# EAGLE design leo_joy_gamer (EAGLE 6.3)
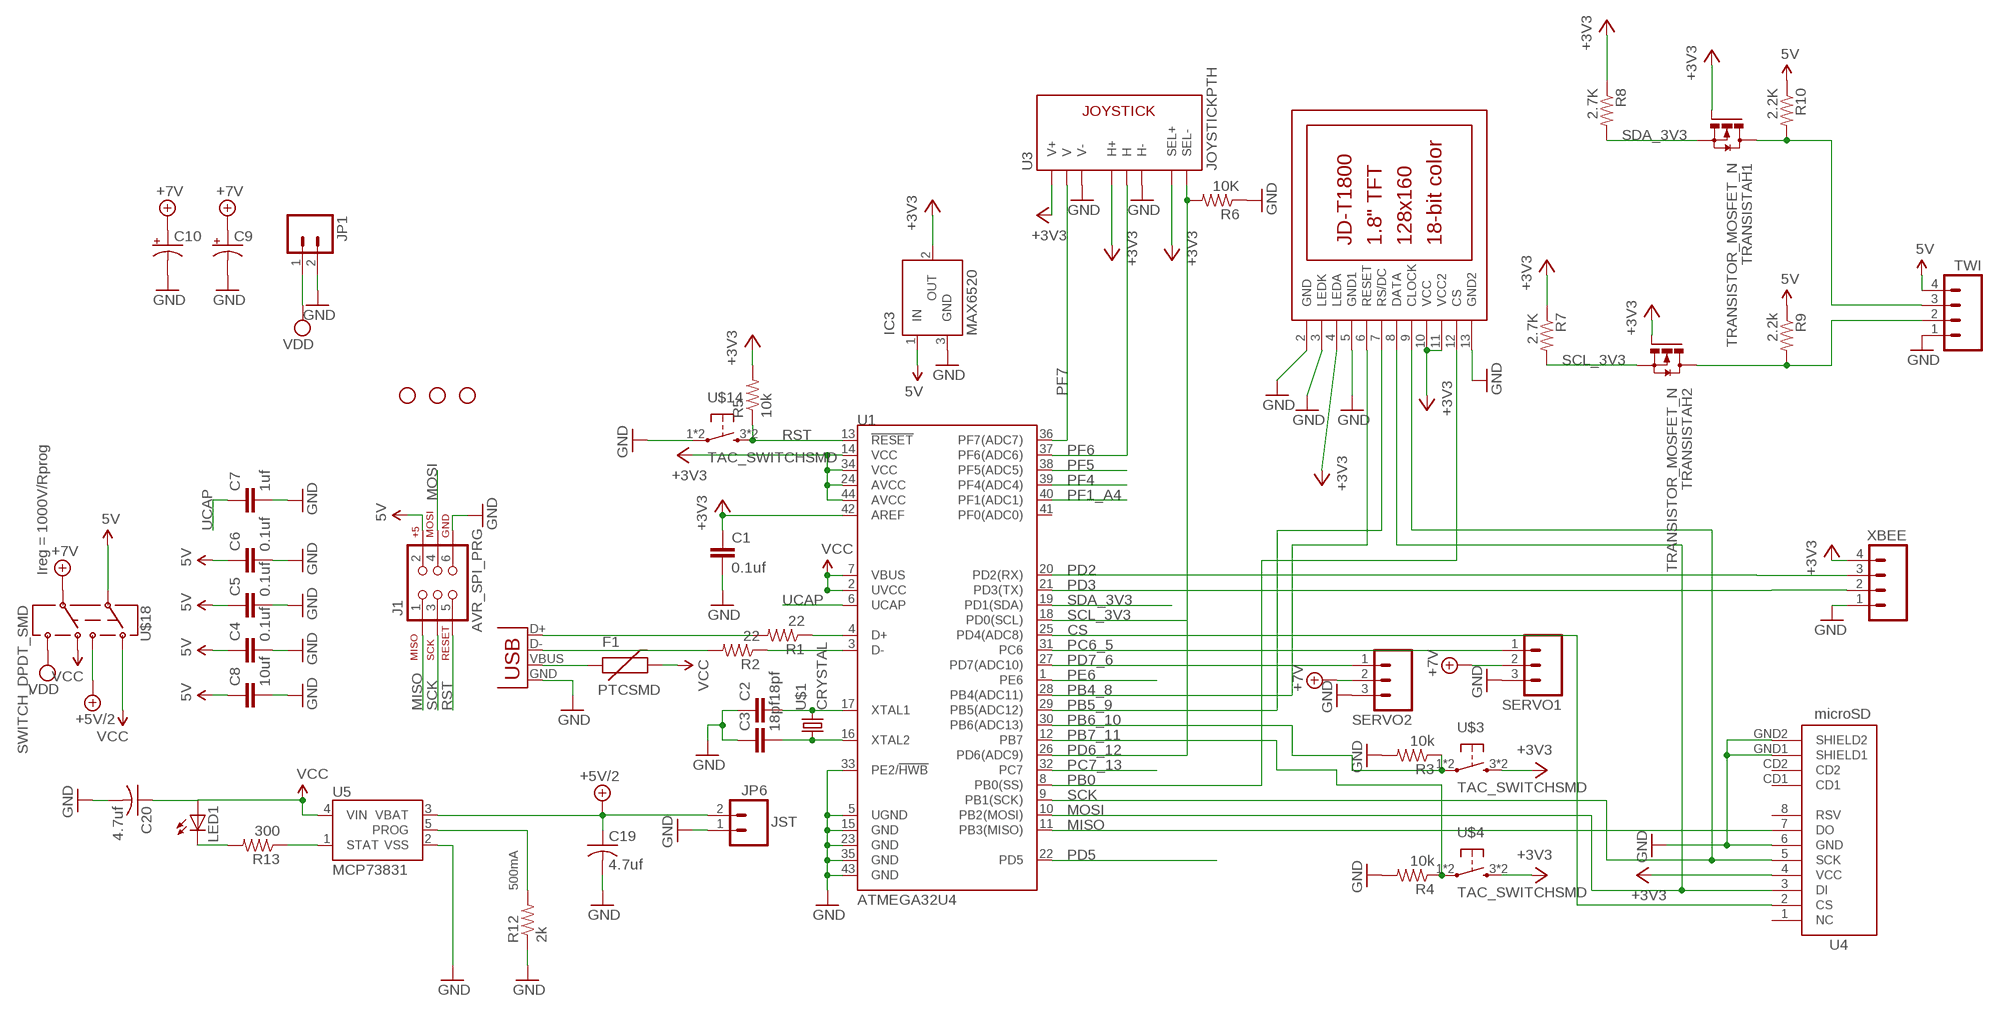
[diagram p0: schematic, sheet 1]

## Parts
C1  0.1uf  CAP0805  [0805]
C2  18pf  CAP0805  [0805]
C3  18pf  CAP0805  [0805]
C4  0.1uf  CAP0805  [0805]
C5  0.1uf  CAP0805  [0805]
C6  0.1uf  CAP0805  [0805]
C7  1uf  CAP0805  [0805]
C8  10uf  CAP0805  [0805]
C9  CPOL-USD  [PANASONIC_D]
C10  CPOL-USD  [PANASONIC_D]
C19  4.7uf  C-USC0603  [C0603]
C20  4.7uf  C-USC0603  [C0603]
F1  PTCSMD  [PTC-1206]
IC3  MAX6520  [SOT23]
J1  AVR_SPI_PRG  AVR_SPI_PRG_6PTH  [2X3]
JP1  M02LOCK  [1X02_LOCK]
JP2  STAND-OFF  [STAND-OFF]
JP3  STAND-OFF  [STAND-OFF]
JP4  STAND-OFF  [STAND-OFF]
JP6  JST  M02JST-PTH-2  [JST-2-PTH]
LCD1  JD-T1800  [JD-T1800]
LED1  LEDCHIPLED_1206  [CHIPLED_1206]
R1  22  R-US_M0805  [M0805]
R2  22  R-US_M0805  [M0805]
R3  10k  R-US_M0805  [M0805]
R4  10k  R-US_M0805  [M0805]
R5  10k  R-US_M0805  [M0805]
R6  10K  R-US_R0603  [R0603]
R7  2.7K  R-US_M0805  [M0805]
R8  2.7K  R-US_M0805  [M0805]
R9  2.2k  R-US_M0805  [M0805]
R10  2.2K  R-US_M0805  [M0805]
R12  2k  R-US_R0805  [R0805]
R13  300  R-US_R0805  [R0805]
SERVO1  M03LOCK  [1X03_LOCK]
SERVO2  M03LOCK  [1X03_LOCK]
TRANSISTAH1  TRANSISTOR_MOSFET_N  [SOT23]
TRANSISTAH2  TRANSISTOR_MOSFET_N  [SOT23]
TWI  M04LOCK  [1X04_LOCK]
U1  ATMEGA32U4  ATMEGA32U4QFN2  [QFN-44-NOPAD]
U3  JOYSTICKPTH  [JOYSTICK]
U4  microSD  USD-SOCKETSMD  [MICRO-SD-SOCKET-PP]
U5  MCP73831  [SOT23-5]
U$1  CRYSTAL  [CRYSTAL_SMD]
U$3  TAC_SWITCHSMD  [TAC_SWITCH_SMD]
U$4  TAC_SWITCHSMD  [TAC_SWITCH_SMD]
U$14  TAC_SWITCHSMD  [TAC_SWITCH_SMD]
U$18  SWITCH_DPDT_SMD  [SWITCH_DPDT]
X2  USB-MICROB  [USB-MICROB]
XBEE  M04LOCK  [1X04_LOCK]

## Nets
5V: C4.1 C5.1 C6.1 C8.1 IC3.1(IN) J1.2 R9.1 R10.1 TWI.4 U$18.7
+3V3: C1.1 IC3.2(OUT) LCD1.4(LEDA) LCD1.10(VCC) LCD1.11(VCC2) R5.2 R7.1 R8.1 TRANSISTAH1.1(G) TRANSISTAH2.1(G) U1.14(VCC) U1.24(AVCC) U1.34(VCC) U1.42(AREF) U1.44(AVCC) U3.B1A(SEL+) U3.H1(H+) U3.V1(V+) U4.4(VCC) U$3.3 U$3.4 U$4.3 U$4.4 XBEE.4
+5V/2: C19.1 JP6.2 U5.3(VBAT) U$18.8
+7V: C9.+ C10.+ SERVO1.2 SERVO2.2 U$18.10
CS: U1.25(PD4(ADC8)) U4.2(CS)
D+: R1.2 X2.D+
D-: R2.2 X2.D-
GND: C1.2 C2.1 C3.1 C4.2 C5.2 C6.2 C7.2 C8.2 C9.- C10.- C19.2 C20.2 IC3.3(GND) J1.6 JP1.2 JP6.1 LCD1.2(GND) LCD1.3(LEDK) LCD1.5(GND1) LCD1.13(GND2) R3.2 R4.2 R6.1 R12.1 SERVO1.3 SERVO2.3 TWI.1 U1.5(UGND) U1.15(GND) U1.23(GND) U1.33(PE2/!HWB) U1.35(GND) U1.43(GND) U3.H3(H-) U3.V3(V-) U4.6(GND) U4.GND1(SHIELD1) U4.GND2(SHIELD2) U5.2(VSS) U$14.1 U$14.2 X2.GND XBEE.1
MISO: J1.1 U1.11(PB3(MISO)) U4.7(DO)
MOSI: J1.4 LCD1.8(DATA) U1.10(PB2(MOSI)) U4.3(DI)
N$2: C2.2 U1.17(XTAL1) U$1.2
N$3: C3.2 U1.16(XTAL2) U$1.1
N$6: R1.1 U1.4(D+)
N$8: R2.1 U1.3(D-)
N$13: R13.1 U5.1(STAT)
N$14: LED1.C R13.2
PB0: LCD1.12(CS) U1.8(PB0(SS))
PB4_8: LCD1.6(RESET) U1.28(PB4(ADC11))
PB5_9: LCD1.7(RS/DC) U1.29(PB5(ADC12))
PB6_10: R3.1 U1.30(PB6(ADC13)) U$3.1 U$3.2
PB7_11: R4.1 U1.12(PB7) U$4.1 U$4.2
PC6_5: SERVO1.1 U1.31(PC6)
PC7_13: U1.32(PC7)
PD2: U1.20(PD2(RX)) XBEE.3
PD3: U1.21(PD3(TX)) XBEE.2
PD5: U1.22(PD5)
PD6_12: R6.2 U1.26(PD6(ADC9)) U3.B2A(SEL-)
PD7_6: SERVO2.1 U1.27(PD7(ADC10))
PE6: U1.1(PE6)
PF1_A4: U1.40(PF1(ADC1))
PF4: U1.39(PF4(ADC4))
PF5: U1.38(PF5(ADC5))
PF6: U1.37(PF6(ADC6)) U3.H2(H)
PF7: U1.36(PF7(ADC7)) U3.V2(V)
PROG: R12.2 U5.5(PROG)
RST: J1.5 R5.1 U1.13(!RESET) U$14.3 U$14.4
SCK: J1.3 LCD1.9(CLOCK) U1.9(PB1(SCK)) U4.5(SCK)
SCL: R9.2 TRANSISTAH2.3(D) TWI.2
SCL_3V3: R7.2 TRANSISTAH2.2(S) U1.18(PD0(SCL))
SDA: R10.2 TRANSISTAH1.3(D) TWI.3
SDA_3V3: R8.2 TRANSISTAH1.2(S) U1.19(PD1(SDA))
UCAP: C7.1 U1.6(UCAP)
VBUS: F1.1 X2.VBUS
VCC: C20.1 F1.2 LED1.A U1.2(UVCC) U1.7(VBUS) U5.4(VIN) U$18.1 U$18.9
VDD: JP1.1 U$18.11
Unconnected: U1.41(PF0(ADC0)) U4.1(NC) U4.8(RSV) U4.CD1 U4.CD2

## Notes on the sheet
- Ireg = 1000V/Rprog
- 500mA

## Library data of the parts
C1-C8 = SparkFun:CAP: Capacitor Standard 0603 ceramic capacitor, and 0.1" leaded capacitor.
C9 C10 = resistor:CPOL-US: POLARIZED CAPACITOR, American symbol
C19 C20 = resistor:C-US: CAPACITOR, American symbol
F1 = SparkFun:PTC: Resettable Fuse PTC Resettable Fuse. Spark Fun Electronics SKU : COM-08357
IC3 = maxim:MAX6520: 1.2V Voltage Reference 50ppm/°C, SOT23, 3-Terminal Source: http://datasheets.maxim-ic.com/en/ds/MAX6520.pdf
J1 = SparkFun:AVR_SPI_PRG_6: AVR ISP 6 Pin This is the reduced ISP connector for AVR programming. Common on Arduino. This footprint will take up less PCB space and can be used with a 10-pin to 6-pin adapter such as SKU: BOB-08508
JP1 JP6 = SparkFun:M02: Header 2 Standard 2-pin 0.1" header. Use with straight break away headers (SKU : PRT-00116), right angle break away headers (PRT-00553), swiss pins (PRT-00743), machine pins (PRT-00117), and female headers (PRT-00115). Molex polarized connector foot print use with SKU : PRT-08233 with associated crimp pins and housings.
JP2-JP4 = SparkFun:STAND-OFF: Stand Off This is the mechanical footprint for a #4 phillips button head screw. Use the keepout ring to avoid running the screw head into surrounding components. SKU : PRT-00447
LCD1 = adafruit:JD-T1800
LED1 = adafruit:LED: LED OSRAM: - CHIPLED LG R971, LG N971, LY N971, LG Q971, LY Q971, LO R971, LY R971 LH N974, LH R974 LS Q976, LO Q976, LY Q976 LO Q996 - Hyper CHIPLED LW Q18S LB Q993, LB Q99A, LB R99A - SideLED LS A670, LO A670, LY A670, LG A670, LP A670 LB A673, LV A673, LT A673, LW A673 LH A674 LY A675 LS A676, LA A676, LO A676, LY A676, LW A676 LS A679, LY A679, LG A679 - Hyper Micro SIDELED® LS Y876, LA Y876, LO Y876, LY Y876 LT Y87S - SmartLED LW L88C, LW L88S LB L89C, LB L89S, LG L890 LS L89K, LO L89K, LY L89K LS L896, LA L896, LO L896, LY L896 - TOPLED LS T670, LO T670, LY T670, LG T670, LP T670 LSG T670, LSP T670, LSY T670, LOP T670, LYG T670 LG T671, LOG T671, LSG T671 LB T673, LV T673, LT T673, LW T673 LH T674 LS T676, LA T676, LO T676, LY T676, LB T676, LH T676, LSB T676, LW T676 LB T67C, LV T67C, LT T67C, LS T67K, LO T67K, LY T67K, LW E67C LS E67B, LA E67B, LO E67B, LY E67B, LB E67C, LV E67C, LT E67C LW T67C LS T679, LY T679, LG T679 LS T770, LO T770, LY T770, LG T770, LP T770 LB T773, LV T773, LT T773, LW T773 LH T774 LS E675, LA E675, LY E675, LS T675 LS T776, LA T776, LO T776, LY T776, LB T776 LHGB T686 LT T68C, LB T68C - Hyper Mini TOPLED® LB M676 - Mini TOPLED Santana® LG M470 LS M47K, LO M47K, LY M47K Source: http://www.osram.convergy.de/
R1-R10 R12 R13 = resistor:R-US_: RESISTOR, American symbol
SERVO1 SERVO2 = SparkFun:M03: Header 3 Standard 3-pin 0.1" header. Use with straight break away headers (SKU : PRT-00116), right angle break away headers (PRT-00553), swiss pins (PRT-00743), machine pins (PRT-00117), and female headers (PRT-00115). Molex polarized connector foot print use with SKU : PRT-08232 with associated crimp pins and housings.
TRANSISTAH1 TRANSISTAH2 = sam:TRANSISTOR_MOSFET_N
TWI XBEE = SparkFun:M04: Header 4 Standard 4-pin 0.1" header. Use with straight break away headers (SKU : PRT-00116), right angle break away headers (PRT-00553), swiss pins (PRT-00743), machine pins (PRT-00117), and female headers (PRT-00115). Molex polarized connector foot print use with SKU : PRT-08231 with associated crimp pins and housings. 1MM SMD Version SKU: PRT-10208
U1 = SparkFun:ATMEGA32U4
U3 = SparkFun:JOYSTICK: Thumb Joystick Joystick commonly found in PS2 controllers. Two pots and a select switch. Footprint proven. Spark Fun Electronics SKU : COM-09032
U4 = SparkFun:USD-SOCKET: microSD Socket Push-push type uSD socket. Schematic element and footprint production proven. Spark Fun Electronics SKU : PRT-00127. tDoc lines correctly indicate media card edge positions when inserting (unlocked, locked, depressed).
U5 = SparkFun:MCP73831: Microchip's MCP73831 Miniature single cell, fully integrated Li-Ion, Li-polymer charge management controller http://ww1.microchip.com/downloads/en/DeviceDoc/21984a.pdf
U$1 = sam:CRYSTAL
U$3 U$4 U$14 = sam:TAC_SWITCH
U$18 = sam:SWITCH_DPDT_SMD
X2 = SparkFun:USB: USB Connectors USB-B-PTH is fully proven SKU : PRT-00139 USB-miniB is fully proven SKU : PRT-00587 USB-A-PCB is untested. USB-A-H is throughly reviewed, but untested. Spark Fun Electronics SKU : PRT-00437 USB-B-SMT is throughly reviewed, but untested. Needs silkscreen touching up. USB-A-S has not been used/tested USB-MB-H has not been used/tested

## Board
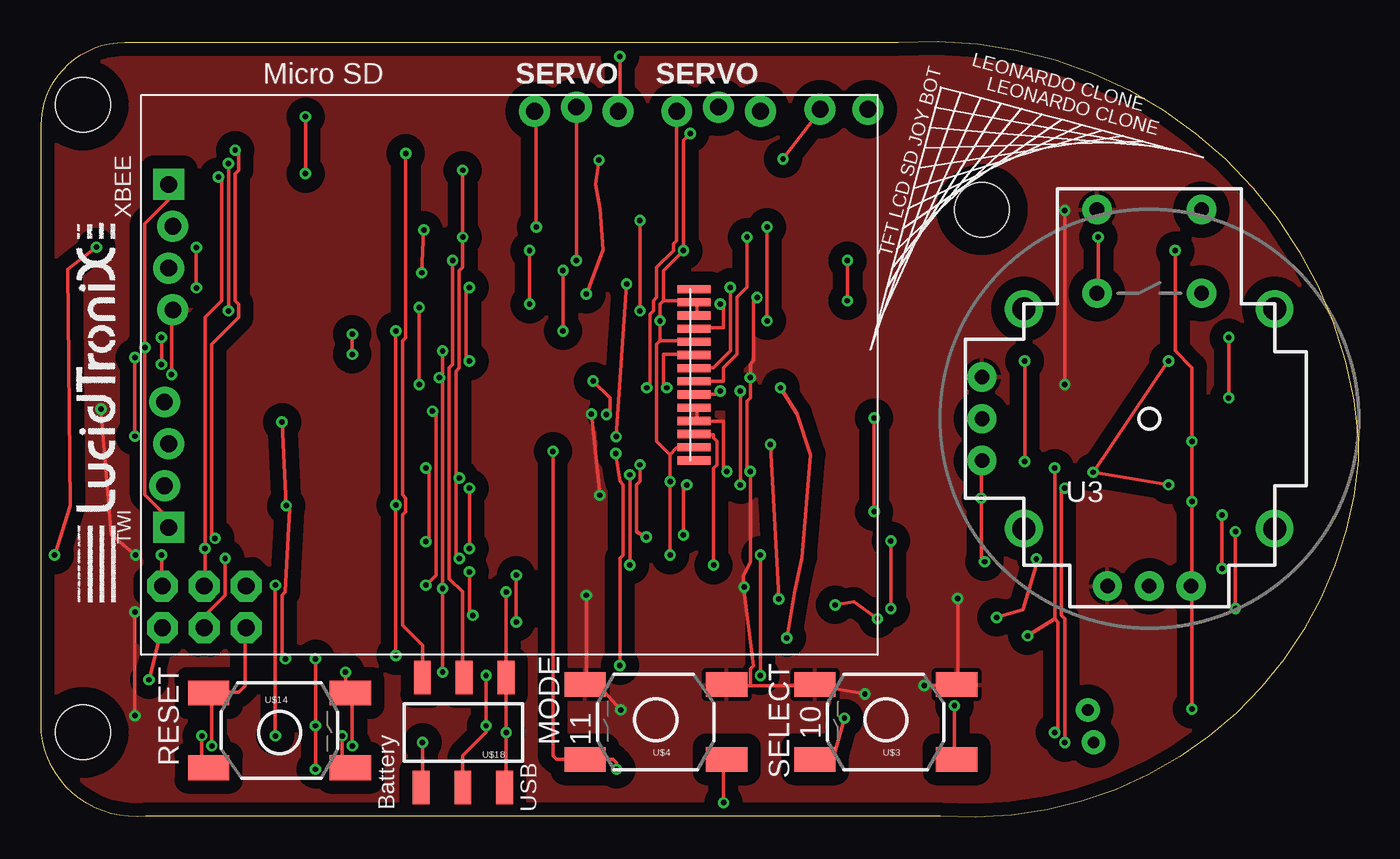
[diagram p1: board, top side]
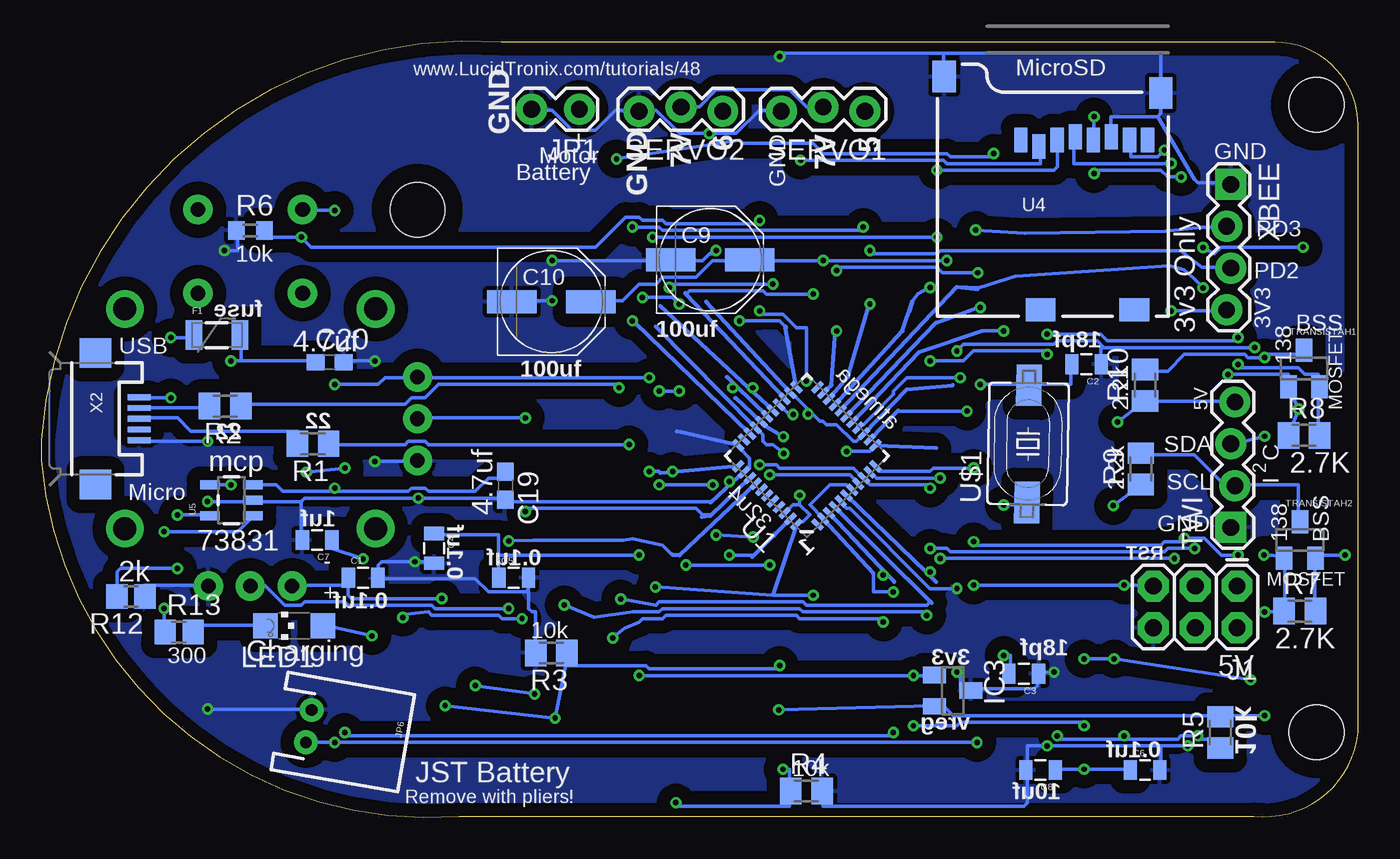
[diagram p2: board, bottom side, seen from below]

Size 80.01 x 47.13 mm. Coordinates in mm from the lower left corner, seen from the top.
Outline: 6.35,0.08 arc-90 0,5.16 0,41.99 arc-90 5.08,47.07 52.07,47.07 arc-90 80.01,22.94 80.01,21.67 arc-90 54.61,0.08 6.35,0.08
Copper layers (1*16): Top 0.0356mm / dielectric 1.5011mm / Bottom 0.0356mm
Design rules "LaenPCBOrder *": minimum track width 8mil, minimum drill 13mil, track to track 6mil, track to pad 6mil, pad to pad 6mil, via to via 6mil, smd to smd 6mil, copper to edge 15mil, drill to drill 6mil, minimum pad ring 7mil, minimum via ring 7mil, stop-mask expansion 4mil, vias tented up to drill 25mil, thermal gap 10mil

### Footprints (pad centres in the part's own frame; a part is rotated, then mirrored left to right if it is on the bottom)
0805 = smd 0.8 x 1.2: 1 -0.9,0; 2 0.9,0
PANASONIC_D = smd 3 x 1.4: + 2.4,0; - -2.4,0
C0603 = smd 1.1 x 1: 1 -0.85,0; 2 0.85,0
PTC-1206 = smd 1 x 1.8: 1 -1.4,0; 2 1.4,0
SOT23 = smd 1 x 1.4: 1 -0.95,-1.1; 2 0.95,-1.1; 3 0,1.1
2X3 = drill 1.016 pad 1.88 octagon: 1 0,0; 2 0,2.54; 3 2.54,0; 4 2.54,2.54; 5 5.08,0; 6 5.08,2.54
1X02_LOCK = drill 1.016 pad 1.88: 1 -0.178,0; 2 2.718,0
STAND-OFF = hole 3.302: 0,0
JST-2-PTH = drill 0.7 pad 1.448: 1 -1,0; 2 1,0
JD-T1800 = smd 0.5 x 2: 1 5.2,-13.1; 2 4.4,-13.1; 3 3.6,-13.1; 4 2.8,-13.1; 5 2,-13.1; 6 1.2,-13.1; 7 0.4,-13.1; 8 -0.4,-13.1; 9 -1.2,-13.1; 10 -2,-13.1; 11 -2.8,-13.1; 12 -3.6,-13.1; 13 -4.4,-13.1; 14 -5.2,-13.1
CHIPLED_1206 = smd 1.5 x 1.5: A 0,-1.75; C 0,1.75
M0805 = smd 1.3 x 1.6: 1 -0.95,0; 2 0.95,0
R0603 = smd 1 x 1.1: 1 -0.85,0; 2 0.85,0
R0805 = smd 1.3 x 1.5: 1 -0.85,0; 2 0.85,0
1X03_LOCK = drill 1.016 pad 1.88: 1 0,0.127; 2 2.54,-0.127; 3 5.08,0.127
1X04_LOCK = drill 1.016 pad 1.88 square: 1 0,0.127 | drill 1.016 pad 1.88: 2 2.54,-0.127; 3 5.08,0.127; 4 7.62,-0.127
QFN-44-NOPAD = smd 0.8 x 0.3: 1 -3.4,2.5; 2 -3.4,2; 3 -3.4,1.5; 4 -3.4,1; 5 -3.4,0.5; 6 -3.4,0; 7 -3.4,-0.5; 8 -3.4,-1; 9 -3.4,-1.5; 10 -3.4,-2; 11 -3.4,-2.5; 23 3.4,-2.5; 24 3.4,-2; 25 3.4,-1.5; 26 3.4,-1; 27 3.4,-0.5; 28 3.4,0; 29 3.4,0.5; 30 3.4,1; 31 3.4,1.5; 32 3.4,2; 33 3.4,2.5 | smd 0.3 x 0.8: 12 -2.5,-3.4; 13 -2,-3.4; 14 -1.5,-3.4; 15 -1,-3.4; 16 -0.5,-3.4; 17 0,-3.4; 18 0.5,-3.4; 19 1,-3.4; 20 1.5,-3.4; 21 2,-3.4; 22 2.5,-3.4; 34 2.5,3.4; 35 2,3.4; 36 1.5,3.4; 37 1,3.4; 38 0.5,3.4; 39 0,3.4; 40 -0.5,3.4; 41 -1,3.4; 42 -1.5,3.4; 43 -2,3.4; 44 -2.5,3.4
JOYSTICK = drill 0.9 pad 1.778: B1A -3.175,12.7; B1B 3.175,12.7; B2A -3.175,7.62; B2B 3.175,7.62 | drill 0.889 pad 1.778: H1 -2.54,-10.16; H2 0,-10.16; H3 2.54,-10.16; V1 -10.16,2.54; V2 -10.16,0; V3 -10.16,-2.54 | drill 1.397 pad 2.286: MOUNT1 -7.62,6.668; MOUNT2 -7.62,-6.668; MOUNT3 7.62,-6.668; MOUNT4 7.62,6.668
MICRO-SD-SOCKET-PP = smd 0.8 x 1.5: 1 -8.94,10.7; 2 -7.84,10.3; 3 -6.74,10.7; 4 -5.64,10.9; 5 -4.54,10.7; 6 -3.44,10.9; 7 -2.34,10.7; 8 -1.24,10.7 | smd 1.8 x 1.4: CD1 -7.75,0.4; CD2 -2.05,0.4 | smd 1.4 x 1.9: GND1 -13.6,14.55; GND2 -0.45,13.55
SOT23-5 = smd 0.55 x 1.2: 1 -0.95,-1.3; 2 0,-1.3; 3 0.95,-1.3; 4 0.95,1.3; 5 -0.95,1.3
CRYSTAL_SMD = smd 2.54 x 1.524: 1 -3.556,0; 2 3.556,0
TAC_SWITCH_SMD = smd 2.5 x 1.5: 1 -4.302,2.397; 2 4.302,2.397; 3 -4.302,-2.143; 4 4.302,-2.143
SWITCH_DPDT = smd 1.016 x 2.032: 1 -2.5,3.333; 7 0.04,3.333; 8 2.58,3.333; 9 -2.58,-3.333; 10 -0.04,-3.333; 11 2.5,-3.333
USB-MICROB = smd 0.35 x 1.4: D+ 0,2.65; D- -0.65,2.65; GND 1.3,2.65; ID 0.65,2.65; VBUS -1.3,2.65 | smd 1.8 x 1.9: MT1 -4,0; MT2 4,0

### Placement (x,y rotation side)
C1  60.45,14.55 0 bottom
C2  16.51,27.51 180 bottom
C3  20.32,8.71 180 bottom
C4  56.13,16.33 270 bottom
C5  51.31,14.55 0 bottom
C6  12.95,2.87 0 bottom
C7  63.25,16.84 180 bottom
C8  19.3,2.87 180 bottom
C9  39.37,33.86 0 bottom
C10  49.02,31.32 0 bottom
C19  51.82,20.14 270 bottom
C20  62.48,27.63 0 bottom
F1  69.34,29.29 0 bottom
IC3  24.64,7.7 270 bottom
J1  7.37,14.05 180 bottom
JP1  47.5,43 180 bottom
JP2  2.54,5.16 0 top
JP3  57.15,36.91 0 top
JP4  2.54,43.26 0 top
JP6  63.75,5.54 260 bottom
LCD1  26.54,26.87 90 top
LED1  64.64,11.63 90 bottom
R1  63.5,22.68 180 bottom
R2  68.83,24.97 180 bottom
R3  49.02,9.98 180 bottom
R4  33.53,1.6 0 bottom
R5  8.38,5.16 90 bottom
R6  67.31,35.64 0 bottom
R7  3.56,12.52 0 bottom
R8  3.3,23.19 0 bottom
R9  13.21,21.16 90 bottom
R10  12.95,26.24 90 bottom
R12  74.55,13.41 180 bottom
R13  71.63,11.25 0 bottom
SERVO1  29.97,43 180 bottom
SERVO2  38.61,43 180 bottom
TRANSISTAH1  3.3,27.25 0 bottom
TRANSISTAH2  3.56,16.84 0 bottom
TWI  7.62,17.6 90 bottom
U1  33.5,21.95 135 bottom
U3  67.31,24.21 0 top
U4  11.56,30.43 0 bottom
U5  68.45,19.25 90 bottom
U$1  20.07,22.68 89 bottom
U$3  51.31,5.92 180 top
U$4  37.34,5.92 180 top
U$6  [LUCIDTRONIX_LOGO_.75_INCH]  5.08,12.52 90 top
U$14  14.48,5.16 0 top
U$18  25.65,5.16 180 top
X2  76.71,24.21 270 bottom
XBEE  7.87,38.43 270 bottom

### Tracks (layer width: path | path; a pad name or v marks a point on that pad's centre or on a via)
5V  (via drill 0.33)
  Top 0.203: v14.63,24 v14.88,18.92 15.09,18.72 14.83,13.69 14.63,13.49 14.63,9.83 v14.83,9.63 | v27.03,8.61 v27.03,5.56 27.03,5.16 25.6,3.73 25.6,1.9 U$18.7 | v16.66,2.92 v16.66,5.56 v16.66,9.63 | v43.69,8.61 v43.69,15.93 | v6.55,8.36 7.32,11.45 J1.2
  Bottom 0.203: v14.88,18.92 13.21,20.19 R9.1 | v14.63,24 13.01,25.27 R10.1 12.8,25.27 7.52,25.27 TWI.4 | 52.22,15.93 52.22,17.14 56.08,17.14 C4.1 | 52.22,15.93 52.22,14.71 C5.1 | C8.1 18.29,2.92 v16.66,2.92 14.02,2.92 C6.1 | IC3.1 25.81,8.61 v27.03,8.61 v43.69,8.61 | v16.66,5.56 16.87,5.77 24.18,5.77 24.38,5.56 v27.03,5.56 | v43.69,15.93 52.22,15.93 | v16.66,9.63 v14.83,9.63 v6.55,8.36
+3V3  (via drill 0.33)
  Top 0.203: v55.68,13.28 55.68,8.2 U$3.3 55.47,8 v53.65,8 | 43.08,8 46.94,8 U$3.4 47.14,8 v50.04,7.49 | 43.08,8 41.66,8 U$4.3 | LCD1.10 39.83,24.87 39.83,24.26 LCD1.11 39.83,24.05 41.45,24.05 41.45,21.21 v41.66,21.01 | v41.25,31.17 41.45,30.96 41.45,29.74 39.83,29.74 LCD1.4 | v43.48,31.57 43.28,31.37 43.28,27.71 43.08,27.51 v43.08,26.69 43.08,25.48 42.88,25.27 42.88,21.21 v43.08,21.01 43.08,15.52 42.65,14.68 42.65,13.99 | 43.08,8 43.08,9.02 43.28,9.22 42.65,13.99 | v33.12,13.49 33.12,8.2 U$4.4 32.92,8 32.11,8 33.93,7.92 v35.2,6.53 | v33.93,19.56 v33.43,24.48 | v42.7,13.99 42.65,13.99 | v5.69,6.17 v5.69,12.47 | v11.38,30.76 v11.38,39.7 | v7.92,26.9 7.92,30.76 XBEE.4 | v5.74,15.93 4.27,17.14 v3.63,24.79 | v62.18,26.29 v62.18,36.85
  Bottom 0.203: 61.37,14.1 61.37,14.5 C1.1 61.37,14.1 | 61.37,14.1 64.62,14.1 U3.H1 | v55.68,13.28 61.16,13.28 61.37,13.49 61.37,14.1 | v41.25,31.17 41.66,31.57 v43.48,31.57 | v43.08,21.01 42.47,21.01 42.42,20.9 | v41.66,21.01 41.65,20.97 | v43.08,26.69 57.1,26.69 U3.V1 57.3,26.69 59.13,26.69 59.54,26.29 v62.18,26.29 | v50.04,7.49 v53.65,8 | 33.53,24.87 34.34,25.68 U1.24 | 33.53,24.87 32.72,24.05 32.51,24.05 32.31,23.85 31.7,23.85 30.68,22.83 30.48,22.83 30.07,23.24 U1.14 | 33.93,18.97 34.34,18.97 34.75,18.57 U1.42 | 33.93,18.97 33.33,18.36 33.73,17.96 33.93,17.96 U1.44 | v33.12,13.49 35.56,13.49 | v35.2,6.53 25.81,6.78 IC3.2 25.6,6.78 25.2,6.78 24.59,6.17 8.53,6.17 R5.2 8.33,6.17 v5.69,6.17 | v33.43,24.48 33.53,24.87 | 33.93,18.97 v33.93,19.56 | 35.56,13.49 v42.7,13.99 | 35.56,13.49 35.56,13.54 | v5.69,12.47 4.67,12.47 R7.1 4.47,12.67 4.47,15.72 TRANSISTAH2.1 5.23,15.93 v5.74,15.93 | R8.1 4.27,23.24 v3.63,24.79 4.27,26.09 TRANSISTAH1.1 4.27,26.29 4.27,26.9 v7.92,26.9 | v11.38,39.7 17.27,39.7 17.27,41.33 U4.4 | v11.38,30.76 8.13,30.76 XBEE.4 | v62.18,36.85 64.01,36.85 U3.B1A
  Bottom 0.229: U1.24 39.62,31.32 | U1.34 41.65,20.97 42.42,20.9 | U1.44 35.56,13.54 | U1.14 27.43,25.98 24.64,26.24
  pour Top (isolate 0.813): -6.22,-16.56 -1.02,55.45 90.42,56.72 81.41,-16.56
+5V/2  (via drill 0.33)
  Top 0.203: v23.16,4.55 23.16,1.9 U$18.8 | v62.18,19.99 61.98,19.79 61.98,12.27 62.18,12.06 v62.18,4.55
  Bottom 0.203: C19.1 51.82,20.6 52.83,20.6 53.65,19.79 56.49,19.79 56.69,19.99 57.51,19.99 57.71,19.79 62.18,19.79 | 62.18,19.79 65.33,19.79 65.73,20.19 67.06,20.19 U5.3 | v23.16,4.55 v62.18,4.55 63.8,4.55 JP6.2 | v62.18,19.99 62.18,19.79
+7V  (via drill 0.33)
  Top 0.203: v24.99,33.81 24.99,27.51 24.79,27.3 24.79,14.5 25.6,13.69 25.6,8.61 U$18.10 | v32.51,33.81 SERVO1.2
  Bottom 0.203: SERVO2.2 41.05,43.15 40.03,43.15 39.01,44.17 34.54,44.17 33.53,43.15 32.51,43.15 SERVO1.2 | v24.99,33.81 v32.51,33.81 36.78,33.81 C9.+ 36.98,33.81 39.22,33.81 40.23,32.79 42.27,32.79 42.67,32.38 43.69,32.38 44.7,31.37 46.53,31.37 C10.+
CS  (via drill 0.33)
  Top 0.203: v33.88,39.9 33.68,38.43 33.93,36.96 34.14,34.47 v33.12,31.77
  Bottom 0.203: v33.88,39.9 25.2,39.9 24.99,39.7 19.3,39.7 19.3,40.72 U4.2 | v33.12,31.77 35.97,31.77 36.17,31.98 40.64,31.98 40.84,31.77
  Bottom 0.229: U1.25 40.84,31.77 40.89,31.83
D+
  Bottom 0.203: X2.D+ 73.97,24.26 71.73,24.26 70.92,23.44 64.41,23.44 64.41,22.83 R1.2
D-
  Bottom 0.203: X2.D- 73.97,24.87 69.9,24.87 R2.2
GND  (via drill 0.33)
  Top 0.203: v10.36,4.34 10.36,7.39 U$14.1 10.36,7.59 11.99,7.59 12.39,8 12.39,11.45 J1.6 | v18.9,4.34 18.9,7.39 U$14.2 18.69,7.39 18.49,7.59 v18.49,8.81 | v69.9,6.58 69.9,13.89 U3.H3 69.9,14.1 v69.9,19.18 v69.9,22.83 69.9,27.3 68.89,28.32 v68.89,34.42 | U3.V3 57.1,21.61 v57.1,19.38 57.1,15.72 v57.3,15.52 | v59.74,21.61 v59.74,27.71 | v35.15,46.2 35.15,42.95 SERVO1.3 | 37.8,31.37 37.59,31.17 v37.59,30.15 37.59,28.93 | 37.8,31.37 39.62,31.37 LCD1.2 | 37.59,28.93 39.62,28.93 LCD1.5 | LCD1.3 39.83,30.56 39.83,31.17 LCD1.2 | 39.83,31.37 LCD1.2 | 38.2,22.02 38.61,22.43 39.62,22.43 LCD1.13 | 38.2,22.02 v38.2,20.4 v38.2,15.93 | 37.59,28.93 37.39,28.73 37.39,22.83 38.2,22.02 | 37.8,31.37 37.8,33.2 v39.01,34.42 39.01,41.12 v39.42,41.53 | v24.38,8.81 v24.38,13.89 24.38,26.49 | XBEE.1 7.72,38.28 7.72,37.46 6.3,36.04 v6.3,28.52 6.3,19.58 7.72,18.16 7.72,17.75 TWI.1 | v24.38,28.32 24.38,26.49 | 24.38,26.49 v24.18,26.69 | v48.97,33.81 v48.97,31.37
  Bottom 0.203: 11.99,4.34 11.99,2.92 C6.2 | v10.36,4.34 11.99,4.34 | v18.49,8.81 19.3,8.81 C3.1 19.51,8.61 19.51,8 19.71,7.8 23.37,7.8 IC3.3 23.57,7.8 24.18,7.8 24.18,8.61 v24.38,8.81 | R4.2 32.51,1.5 32.51,0.69 20.32,0.69 20.12,0.89 20.12,2.72 C8.2 20.12,2.92 20.12,4.34 v18.9,4.34 11.99,4.34 | 12.19,42.54 15.04,42.54 15.04,41.53 U4.6 | 12.19,42.54 11.99,42.75 11.99,43.97 U4.GND2 11.99,44.17 11.99,46.41 25.2,46.41 | 12.19,42.54 9.96,38.73 9.75,38.53 7.92,38.53 7.92,38.48 XBEE.1 | 64.21,19.18 64.21,16.94 C7.2 | 64.21,19.18 67.06,19.18 U5.2 67.26,19.18 v69.9,19.18 | v69.9,22.83 73.97,22.83 X2.GND | R12.1 73.76,13.49 73.76,14.1 69.9,14.1 U3.H3 | v69.9,6.58 63.6,6.58 JP6.1 | 50.6,13.69 52.83,13.69 53.65,14.5 59.54,14.5 C1.2 59.54,14.71 59.54,15.32 59.33,15.52 v57.3,15.52 56.29,15.52 C4.2 | 50.6,13.69 50.39,13.89 50.39,14.5 C5.2 | 50.6,13.69 50.39,13.69 50.39,12.67 50.19,12.47 49.99,12.47 49.99,10.03 R3.2 | v59.74,27.71 61.57,27.71 C20.2 | v59.74,21.61 57.3,21.61 U3.V3 | 64.21,19.18 64.01,19.38 v57.1,19.38 51.82,19.38 C19.2 51.82,19.18 39.42,19.18 39.36,19.11 | 43.69,42.95 42.67,42.95 41.25,41.53 v39.42,41.53 37.8,41.53 36.37,42.95 35.15,42.95 SERVO1.3 | 43.69,42.95 45.11,42.95 46.33,41.73 47.75,41.73 48.97,42.95 50.19,42.95 JP1.2 | 43.69,42.95 SERVO2.3 | 25.2,46.41 25.2,44.98 U4.GND1 | 25.2,46.41 34.95,46.41 v35.15,46.2 | v37.59,30.15 35.15,30.15 34.75,29.74 34.79,29.74 | v38.2,20.4 38,20.4 37.97,20.37 | U1.33 37.59,22.43 36.98,21.82 36.98,21.21 37.19,21.01 U1.35 | v38.2,15.93 36.78,15.93 36.75,15.9 | v39.01,34.42 39.22,34.21 39.42,34.21 39.83,33.81 41.66,33.81 C9.- 41.86,33.81 v48.97,33.81
  Bottom 0.203: v24.38,13.89 26.01,13.89 30.89,18.77 31.09,18.77 31.5,19.18 U1.5 | v24.18,26.69 27.43,26.69 28.25,25.88 28.25,25.68 30.07,23.85 30.28,23.85 U1.15 | v6.3,28.52 15.44,28.52 | 15.44,28.52 15.65,28.52 15.65,27.51 C2.1 | v24.38,28.32 23.98,28.73 18.49,28.73 18.29,28.93 15.85,28.93 15.44,28.52 | v68.89,34.42 68.07,34.42 68.07,35.64 R6.1 | v48.97,31.37 51.41,31.37 C10.-
  Bottom 0.229: U1.23 34.79,29.74 34.8,29.79 | U1.33 41.4,23.44 | U1.35 37.97,20.37 39.36,19.11 39.37,19.13 | U1.43 36.75,15.9 36.83,15.82
  pour Bottom (isolate 0.813): -0.51,56.84 -11.3,-18.09 76.33,-19.36 87.12,55.57
MISO  (via drill 0.33)
  Top 0.203: v23.37,21.21 23.57,21.01 23.57,16.94 v23.37,16.74 | v7.32,15.93 7.32,14.1 J1.1 | v11.79,40.51 11.99,40.31 11.99,39.29 11.79,39.09 11.79,31.37 11.99,31.17 11.99,30.35 10.36,28.73 10.36,17.14 v10.57,16.94
  Bottom 0.203: v23.37,21.21 25.81,21.21 26.01,21.01 29.06,21.01 29.26,21.21 U1.11 | v23.37,16.74 23.16,16.53 11.99,16.53 11.79,16.74 10.57,16.74 10.36,16.94 | 10.36,16.94 9.35,16.94 8.33,15.93 v7.32,15.93 | v11.79,40.51 12.19,40.11 13.82,40.11 13.82,41.12 U4.7 | 10.36,16.94 v10.57,16.94
MOSI  (via drill 0.33)
  Top 0.203: 25.2,20.8 25.2,27.1 25.4,27.3 25.4,33.2 25.6,33.4 v25.6,35.23 v25.6,39.29 | v42.88,35.23 42.88,32.18 42.27,31.57 42.27,28.12 41.45,27.3 41.45,26.49 39.83,26.49 LCD1.8 | v11.18,15.72 11.18,13.49 9.96,12.27 9.96,11.66 J1.4 | v25.4,15.72 25.2,15.93 25.2,20.8 | 25.2,20.8 v25.4,20.6
  Bottom 0.203: v25.4,20.6 29.26,20.6 29.67,21.01 U1.10 | v25.6,39.29 18.49,39.29 18.29,39.5 18.29,41.12 U4.3 | v25.6,35.23 v42.88,35.23 | v25.4,15.72 v11.18,15.72
N$2  (via drill 0.33)
  Top 0.203: v22.96,30.96 v22.96,26.29
  Bottom 0.203: C2.2 17.48,27.51 17.48,26.29 19.91,26.29 U$1.2 20.12,26.29 v22.96,26.29 | v22.96,30.96 22.98,31.02
  Bottom 0.229: U1.17 25.65,30.05 22.98,31.02 22.86,31.06
N$3  (via drill 0.33)
  Top 0.203: v21.54,9.83 v21.54,18.97 v21.54,29.54
  Bottom 0.203: v21.54,9.83 21.13,9.83 21.13,8.81 C3.2 | v21.54,18.97 20.32,18.97 U$1.1 | v21.54,29.54 22.86,29.54
  Bottom 0.229: U1.16 26.67,28.27 22.86,29.54
N$6  (via drill 0.33)
  Top 0.203: v44.81,13.26 v44.3,22.63
  Bottom 0.203: v44.3,22.63 56.49,22.63 56.69,22.83 57.71,22.83 57.91,22.63 62.38,22.63 R1.1 | v44.81,13.26 42.67,12.88 42.47,13.08 33.73,13.08 33.53,12.88 26.21,12.88 26.01,13.08 25.98,13.11
  Bottom 0.229: U1.4 25.98,13.11 25.91,13.03
N$8  (via drill 0.33)
  Top 0.203: v44.91,26.09 45.92,24.51 46.74,22.02 46.23,15.77 45.8,13.79 v45.29,10.9 | v28.85,14.71 v28.85,11.86
  Bottom 0.203: v44.91,26.09 45.11,26.29 55.88,26.29 56.69,25.48 57.51,25.48 57.91,25.07 67.87,25.07 R2.1 | v45.29,10.9 44.58,11.48 43.69,11.86 43.48,12.06 42.27,12.06 42.06,12.27 34.14,12.27 33.93,12.06 29.06,12.06 v28.85,11.86 | v28.85,14.71 28.65,14.71 28.61,14.74
  Bottom 0.229: U1.3 28.61,14.74 28.19,14.3
N$13  (via drill 0.33)
  Top 0.203: v72.54,12.67 v72.54,17.35
  Bottom 0.203: v72.54,17.35 68.07,17.35 67.26,18.16 U5.1 | v72.54,12.67 72.54,11.25 R13.1
N$14
  Bottom 0.203: LED1.C 66.45,11.66 70.71,11.66 70.71,11.25 R13.2
PB0  (via drill 0.33)
  Top 0.203: v40.84,15.32 40.84,21.21 41.05,21.41 41.05,22.83 40.84,23.04 40.84,23.24 39.83,23.24 LCD1.12 | v35.76,20.8 v35.76,15.32
  Bottom 0.203: v35.76,15.32 v40.84,15.32 | v35.76,20.8 30.89,20.8 30.48,20.4 U1.8
PB4_8  (via drill 0.33)
  Top 0.203: v38,26.09 37.8,26.29 37.8,28.12 39.62,28.12 LCD1.6
  Bottom 0.203: v38,26.09 37.8,26.09 37.74,26.14
  Bottom 0.229: U1.28 37.74,26.14 38.35,26.75
PB5_9  (via drill 0.33)
  Top 0.203: v35.56,32.38 v34.92,23.11 | v41.86,32.18 41.86,28.32 40.84,27.3 39.83,27.3 LCD1.7
  Bottom 0.203: v34.92,23.11 36.17,23.85 U1.29 | v35.56,32.38 41.66,32.38 v41.86,32.18
  Bottom 0.229: U1.29 37.85,25.48
PB6_10  (via drill 0.33)
  Top 0.203: v48.79,6.02 48.16,3.73 47.95,3.53 47.14,3.53 U$3.2 | v55.47,6.78 55.47,3.53 U$3.1 | v34.9,22.1 35.15,20.4 35.36,20.19 35.36,15.93 35.15,15.72 v35.15,9.22
  Bottom 0.203: 48.16,9.22 v48.79,6.02 v55.47,6.78 | 48.16,9.22 48.16,9.83 R3.1 48.16,9.22 | v34.9,22.1 35.56,22.63 35.97,22.63 36.17,22.83 36.17,23.24 36.58,23.65 U1.30 | v35.15,9.22 35.36,9.02 43.08,9.02 43.28,9.22 48.16,9.22
  Bottom 0.229: U1.30 42.67,29.79
PB7_11  (via drill 0.33)
  Top 0.203: v34.95,2.92 34.95,3.33 34.75,3.53 33.12,3.53 U$4.2 32.92,3.53 31.29,3.53 31.09,3.73 v31.09,22.22 | v41.45,0.89 41.45,3.33 U$4.1
  Bottom 0.203: v34.95,2.92 34.54,2.92 34.54,1.7 R4.1 34.54,1.5 34.54,0.69 41.25,0.69 v41.45,0.89 | v31.09,22.22 29.67,22.22 29.46,22.43 U1.12
  Bottom 0.229: U1.12 25.65,22.43
PC6_5  (via drill 0.33)
  Top 0.203: v30.07,35.84 30.07,42.75 SERVO1.1 | v44.09,30.15 v44.09,35.84
  Bottom 0.203: v30.07,35.84 30.28,35.64 42.27,35.64 42.47,35.84 v44.09,35.84 | v44.09,30.15 43.89,30.15 43.94,30.05
  Bottom 0.229: U1.31 43.94,30.05
PD2  (via drill 0.33)
  Top 0.203: v29.67,34.42 v29.67,31.17
  Bottom 0.203: v29.67,34.42 29.46,34.21 25.6,34.21 25.4,34.42 10.77,34.42 9.5,33.4 7.92,33.4 XBEE.3 | v29.67,31.17 29.72,31.06
  Bottom 0.229: U1.20 30.99,26.75 29.72,31.06
PD3  (via drill 0.33)
  Top 0.203: v31.7,33.2 v31.7,29.54 | v23.24,35.66 v23.11,33.07
  Bottom 0.203: v31.7,33.2 31.5,33.4 25.6,33.4 25.27,33.07 v23.11,33.07 | v23.24,35.66 20.24,35.46 11.71,35.58 9.55,35.84 8.13,35.84 XBEE.2 | v31.7,29.54 31.75,29.54
  Bottom 0.229: U1.21 32,26.24 31.75,29.54
PD6_12  (via drill 0.33)
  Top 0.203: v34.34,24.46 34.54,24.66 34.54,25.48 v33.53,26.49 | v36.37,36.25 v36.37,30.76 | v64.21,35.23 64.21,31.98 U3.B2A
  Bottom 0.203: v34.34,24.46 34.54,24.46 35.15,25.07 U1.26 | v33.53,26.49 33.53,29.74 34.14,29.74 34.95,30.56 36.17,30.56 v36.37,30.76 | v36.37,36.25 36.58,36.04 42.06,36.04 42.27,36.25 43.48,36.25 43.69,36.45 44.5,36.45 46.33,34.62 63.6,34.62 v64.21,35.23 66.45,35.23 66.45,35.64 R6.2
PD7_6  (via drill 0.33)
  Top 0.203: SERVO2.1 38.61,35.03 38.41,34.82 38.41,34.42 37.39,33.4 37.39,31.57 37.19,31.37 37.19,30.76 36.98,30.56 36.98,26.29 v36.78,26.09
  Bottom 0.203: v36.78,26.09 36.98,26.09 37.01,26.06
  Bottom 0.229: U1.27 37.01,26.06 42.42,31.06
PF6  (via drill 0.33)
  Top 0.203: v51.61,16.79 v51.61,12.67
  Bottom 0.203: v51.61,12.67 56.08,12.67 56.29,12.88 61.37,12.88 61.57,13.08 64.01,13.08 64.21,12.88 65.23,12.88 66.45,14.1 67.26,14.1 U3.H2 | v51.61,16.79 50.14,16.84 44.68,16.84 44.09,16.92 42.27,16.53 41.66,15.93 41.25,15.93 41.23,15.91
  Bottom 0.229: U1.37 41.23,15.91 41.66,15.95
PF7  (via drill 0.33)
  Top 0.203: v50.6,24.26 v50.6,18.57
  Bottom 0.203: v50.6,18.57 50.39,18.77 40.23,18.77 39.83,18.36 39.42,18.36 39.36,18.3 | v50.6,24.26 57.1,24.26 U3.V2
  Bottom 0.229: U1.36 39.36,18.3 39.88,18.24
PROG  (via drill 0.33)
  Top 0.203: v71.73,15.11 v71.73,18.36
  Bottom 0.203: v71.73,18.36 69.9,18.36 U5.5 | v71.73,15.11 75.18,15.11 75.39,14.91 75.39,13.49 R12.2
RST  (via drill 0.33)
  Top 0.203: v9.75,4.95 9.75,2.92 10.16,2.92 U$14.3 | v18.29,4.95 18.29,2.92 18.69,2.92 U$14.4 | v23.77,24.66 23.98,24.46 23.98,14.71 v23.37,14.1 | v14.22,14.1 v14.22,4.95
  Bottom 0.203: R5.1 8.53,4.34 8.94,4.75 9.55,4.75 v9.75,4.95 10.77,4.95 10.97,4.75 14.22,4.75 | v18.29,4.95 18.09,4.75 14.22,4.75 | v23.77,24.66 27.84,24.66 27.94,24.71 | v23.37,14.1 v14.22,14.1 12.6,14.1 J1.5 | v14.22,4.95 14.22,4.75
  Bottom 0.229: U1.13 27.94,24.71
SCK  (via drill 0.33)
  Top 0.203: v41.25,25.88 41.05,25.68 39.83,25.68 LCD1.9 | v42.47,20.19 v42.47,25.88 | v39.22,20.19 39.01,19.99 v39.01,17.14 | v36.75,17.02 36.17,17.35 36.17,20.19 36.37,20.4 v36.37,21.41 | v16.05,39.09 v16.05,42.54 | v10.77,38.89 10.97,38.68 10.97,31.37 9.96,30.35 v9.96,16.33 9.96,14.1 J1.3 | v26.01,16.33 v26.01,19.99
  Bottom 0.203: v42.47,25.88 v41.25,25.88 | v39.22,20.19 v42.47,20.19 | v36.75,17.02 v39.01,17.14 | v36.37,21.41 35.36,21.41 35.15,21.21 30.68,21.21 30.07,20.6 | v16.05,42.54 16.05,41.33 U4.5 | v16.05,39.09 16.05,39.29 11.99,39.29 11.58,38.89 v10.77,38.89 | 30.07,20.6 29.67,20.19 26.21,20.19 v26.01,19.99 | v26.01,16.33 24.99,16.33 24.79,16.13 11.79,16.13 11.58,16.33 v9.96,16.33 | 30.07,20.6 U1.9
SCL
  Bottom 0.203: TRANSISTAH2.3 3.66,17.96 3.66,20.19 7.32,20.19 TWI.2 7.52,20.19 8.13,20.19 9.96,22.02 13.21,22.02 R9.2
SCL_3V3  (via drill 0.33)
  Top 0.203: v0.81,15.93 1.75,18.92 1.63,33.27 v3.35,34.62 | v9.42,32.16 v9.42,34.59
  Bottom 0.203: R7.2 2.64,12.67 2.64,15.72 TRANSISTAH2.2 2.44,15.93 v0.81,15.93 | v3.35,34.62 8.33,34.62 8.74,34.21 v9.42,34.59 | v9.42,32.16 10.01,32.74 10.59,33.25 11.48,33.5 20.83,32.87 23.06,32.16 24.39,32.21
  Bottom 0.229: U1.18 24.39,32.21 23.11,32.08
SDA  (via drill 0.33)
  Top 0.203: v5.69,27.91 v5.69,23.14
  Bottom 0.203: 3.45,28.17 TRANSISTAH1.3 3.45,28.12 5.69,28.12 5.89,27.91 | 5.89,27.91 6.71,27.91 6.91,28.12 10.57,28.12 11.58,27.1 12.8,27.1 R10.2 | v5.69,23.14 7.72,22.63 TWI.3 | 5.89,27.91 v5.69,27.91
SDA_3V3  (via drill 0.33)
  Top 0.203: v7.32,29.13 v7.32,27.51 | v18.9,28.12 v18.9,29.34 | v26.01,27.71 25.81,27.91 25.81,31.98 v26.01,32.18
  Bottom 0.203: R8.2 2.44,23.24 2.44,26.09 TRANSISTAH1.2 2.44,26.29 2.44,26.9 3.25,26.9 3.66,27.3 7.11,27.3 v7.32,27.51 | v7.32,29.13 7.52,28.93 15.24,28.93 15.65,29.34 v18.9,29.34 | v18.9,28.12 19.1,28.32 23.37,28.32 23.98,27.71 v26.01,27.71 | v26.01,32.18 26.75,31.8 27.09,31.33
  Bottom 0.229: U1.19 27.69,29.54 27.09,31.33 27.3,30.68
UCAP  (via drill 0.33)
  Top 0.203: v60.45,15.7 60.4,15.11 59.64,12.6 v58.04,12.14 | v50.8,12.06 49.38,13.08 v48.23,12.9 | v26.21,12.27 26.01,12.47 v26.01,14.91
  Bottom 0.203: v60.45,15.7 62.38,16.33 62.38,16.74 C7.1 | v58.04,12.14 57.84,12.34 56.49,12.47 56.29,12.27 52.22,12.27 52.02,12.06 v50.8,12.06 | v48.23,12.9 46.43,12.14 44.07,12.47 42.47,12.47 42.27,12.67 33.93,12.67 33.73,12.47 26.42,12.47 v26.21,12.27 | v26.01,14.91 26.21,14.91 26.25,14.87
  Bottom 0.229: U1.6 26.25,14.87 25.65,14.3
VBUS  (via drill 0.33)
  Top 0.203: v72.14,29.13 v72.14,25.48
  Bottom 0.203: v72.14,25.48 73.97,25.48 X2.VBUS | v72.14,29.13 70.92,29.13 F1.1
VCC  (via drill 0.33)
  Top 0.203: v28.25,13.69 28.25,8.61 U$18.9 28.25,8.41 v28.25,5.16 28.25,1.9 U$18.1 | v68.48,27.71 v63.91,20.95 v68.48,20.19 | v61.57,21.21 61.57,12.06 | 61.57,12.06 v59.92,11.02 | v61.57,5.16 61.77,5.36 61.77,11.86 61.57,12.06
  Bottom 0.203: U1.7 30.89,19.99 31.09,20.19 32.11,20.19 33.33,18.97 32.51,18.16 U1.2 | 29.46,14.81 29.46,13.69 v28.25,13.69 | 67.87,27.71 67.87,29.13 F1.2 | 67.87,27.71 63.4,27.71 C20.1 | v68.48,20.19 69.7,20.19 U5.4 | 67.87,27.71 v68.48,27.71 | v59.92,11.02 62.79,11.66 LED1.A | v63.91,20.95 v61.57,21.21 | v28.25,5.16 28.45,4.95 61.37,4.95 v61.57,5.16
  Bottom 0.229: U1.2 29.46,14.81
VDD  (via drill 0.33)
  Top 0.203: v22.15,40.31 22.15,29.13 21.95,28.93 21.95,19.58 22.15,19.38 22.15,18.57 21.95,18.36 21.95,11.66 23.16,10.44 23.16,8.61 U$18.11 | v45.06,39.98 47.35,42.95 JP1.1
  Bottom 0.203: v22.15,40.31 22.35,40.11 24.79,40.11 24.99,40.31 32.51,40.31 33.12,40.92 37.39,40.92 37.59,41.12 v45.06,39.98

### Text on the board
tPlace: SERVO | SERVO | LEONARDO CLONE | Micro SD | LEONARDO CLONE | XBEE | TFT LCD SD JOY BOT | TWI | 10 | MODE | 11 | RESET | SELECT | Battery | USB
bPlace: MicroSD | www.LucidTronix.com/tutorials/48 | 7V | GND | 5 | 7V | GND | 6 | GND | GND | + | Motor | Battery | PD3 | 10k | PD2 | 3V3 | fuse | MOSFET | BSS | 3v3 Only | 18pf | 100uf | 4.7uf | USB | 138 | 100uf | 5V | 2.2k | 22 | SDA | atmega | 22 | 2.7K | C | 2 | SCL | mcp | I | 2.2k | 32u4 | Micro | GND | 4.7uf | 1uf | BSS | 138 | 73831 | RST | 1 | 0.1uf | - | MOSFET | 0.1uf | 0.1uf | 2k | + | 10k | 2.7K | 5V | 18pf | 300 | 3v3 | Charging | vreg | 0.1uf | 10k | JST | 10uf | 10k | Battery | Remove with pliers!